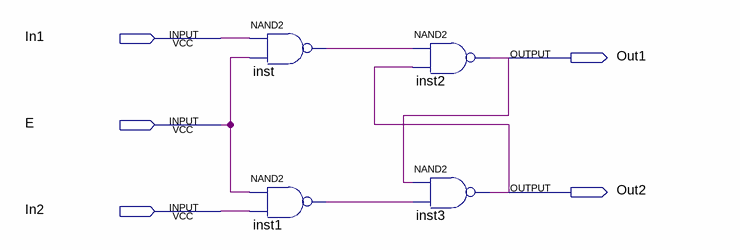
[diagram p0: schematic sheet]
// Quartus schematic ClockedSR.bdf as structural Verilog: 4 symbols, 5 pins
module ClockedSR (
  input  In1,
  input  E,
  input  In2,
  output Out1,
  output Out2
);

  wire inst1_out, inst_out;

  nand inst (inst_out, In1, E);
  nand inst1 (inst1_out, E, In2);
  nand inst2 (Out1, inst_out, Out2);
  nand inst3 (Out2, Out1, inst1_out);
endmodule
